# EAGLE schematic test1 (EAGLE 9.6.2)
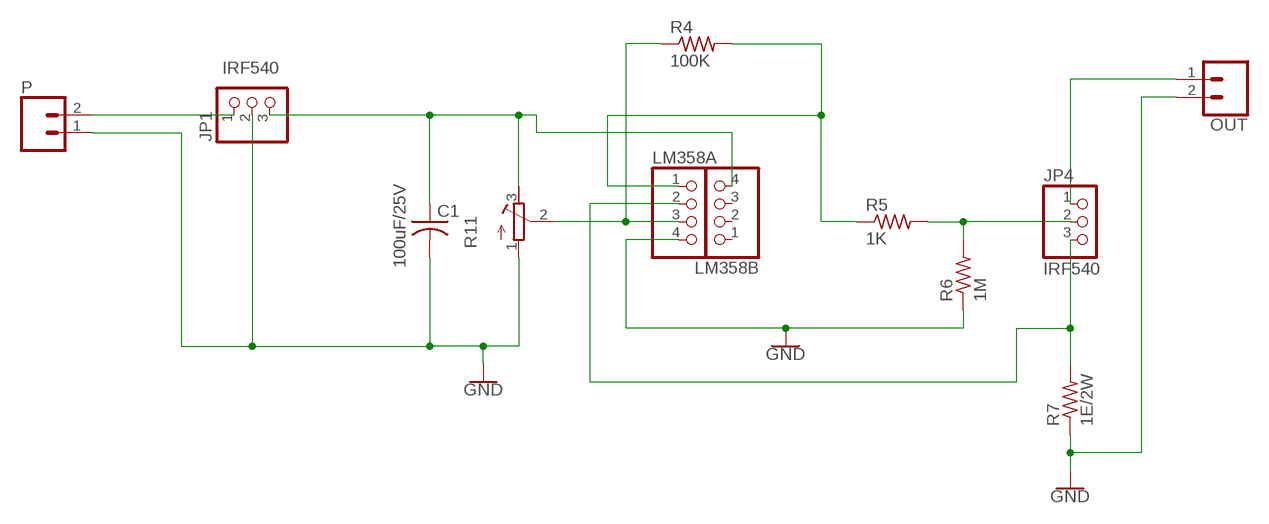
[diagram p0: schematic, sheet 1]

## Parts
C1  100uF/25V  C-US025-024X044  [C025-024X044]
JP1  IRF540  PINHD-1X3  [1X03]
JP4  IRF540  PINHD-1X3  [1X03]
LM358A  PINHD-1X4  [1X04]
LM358B  PINHD-1X4  [1X04]
OUT  CONN_02  [1X02]
P  CONN_02  [1X02]
R4  100K  R-US_0204/5  [0204/5]
R5  1K  R-US_0204/5  [0204/5]
R6  1M  R-US_0204/5  [0204/5]
R7  1E/2W  R-US_0204/5  [0204/5]
R11  R-TRIMM3339P  [RTRIM3339P]

## Nets
GND: C1.2 JP1.2 LM358A.4 OUT.2 P.1 R6.1 R7.1 R11.1(A)
N$1: JP1.1 P.2
N$3: JP4.1 OUT.1
N$6: JP4.3 LM358A.2 R7.2
N$9: LM358A.3 R4.1 R11.2(S)
N$10: LM358A.1 R4.2 R5.1
N$11: JP4.2 R5.2 R6.2
O1+: C1.1 JP1.3 LM358B.4 R11.3(E)
Unconnected: LM358B.1 LM358B.2 LM358B.3

## Library data of the parts
C1 = rcl:C-US: CAPACITOR, American symbol; SPICEPREFIX: C
JP1 JP4 = pinhead:PINHD-1X3: PIN HEADER
LM358A LM358B = pinhead:PINHD-1X4: PIN HEADER
OUT P = SparkFun-Connectors:CONN_02: Multi connection point. Often used as Generic Header-pin footprint for 0.1 inch spaced/style header connections On any of the 0.1 inch spaced packages, you can populate with these: Break Away Headers - Straight <https://www.sparkfun.com/products/116> (PRT-00116) Break Away Male Headers - Right Angle <https://www.sparkfun.com/products/553> (PRT-00553) Female Headers <https://www.sparkfun.com/products/115> (PRT-00115) Break Away Headers - Machine Pin <https://www.sparkfun.com/products/117> (PRT-00117) Break Away Female Headers - Swiss Machine Pin <https://www.sparkfun.com/products/743> (PRT-00743) For SCREWTERMINALS and SPRING TERMINALS visit here: Screw Terimnals on SparkFun.com <https://www.sparkfun.com/search/results?term=Screw+Terminals> (5mm/3.5mm/2.54mm spacing) This device is also useful as a general connection point to wire up your design to another part of your project. Our various solder wires solder well into these plated through hole pads. Hook-Up Wire - Assortment (Stranded, 22 AWG) <https://www.sparkfun.com/products/11375> (PRT-11375) Hook-Up Wire - Assortment (Solid Core, 22 AWG) <https://www.sparkfun.com/products/11367> (PRT-11367) View the entire wire category on our website here <https://www.sparkfun.com/categories/141> Special notes: Molex polarized connector foot print use with: PRT-08233 with associated crimp pins and housings. 2.54_SCREWTERM for use with PRT-10571. 3.5mm Screw Terminal footprints for PRT-08084 5mm Screw Terminal footprints for use with PRT-08432
R4-R7 = rcl:R-US_: RESISTOR, American symbol; SPICEPREFIX: R
R11 = rcl:R-TRIMM: Trimm resistor; SPICEMODEL: X; SPICEPREFIXL: POT